# EAGLE design MainControlBoard (EAGLE 5.11)
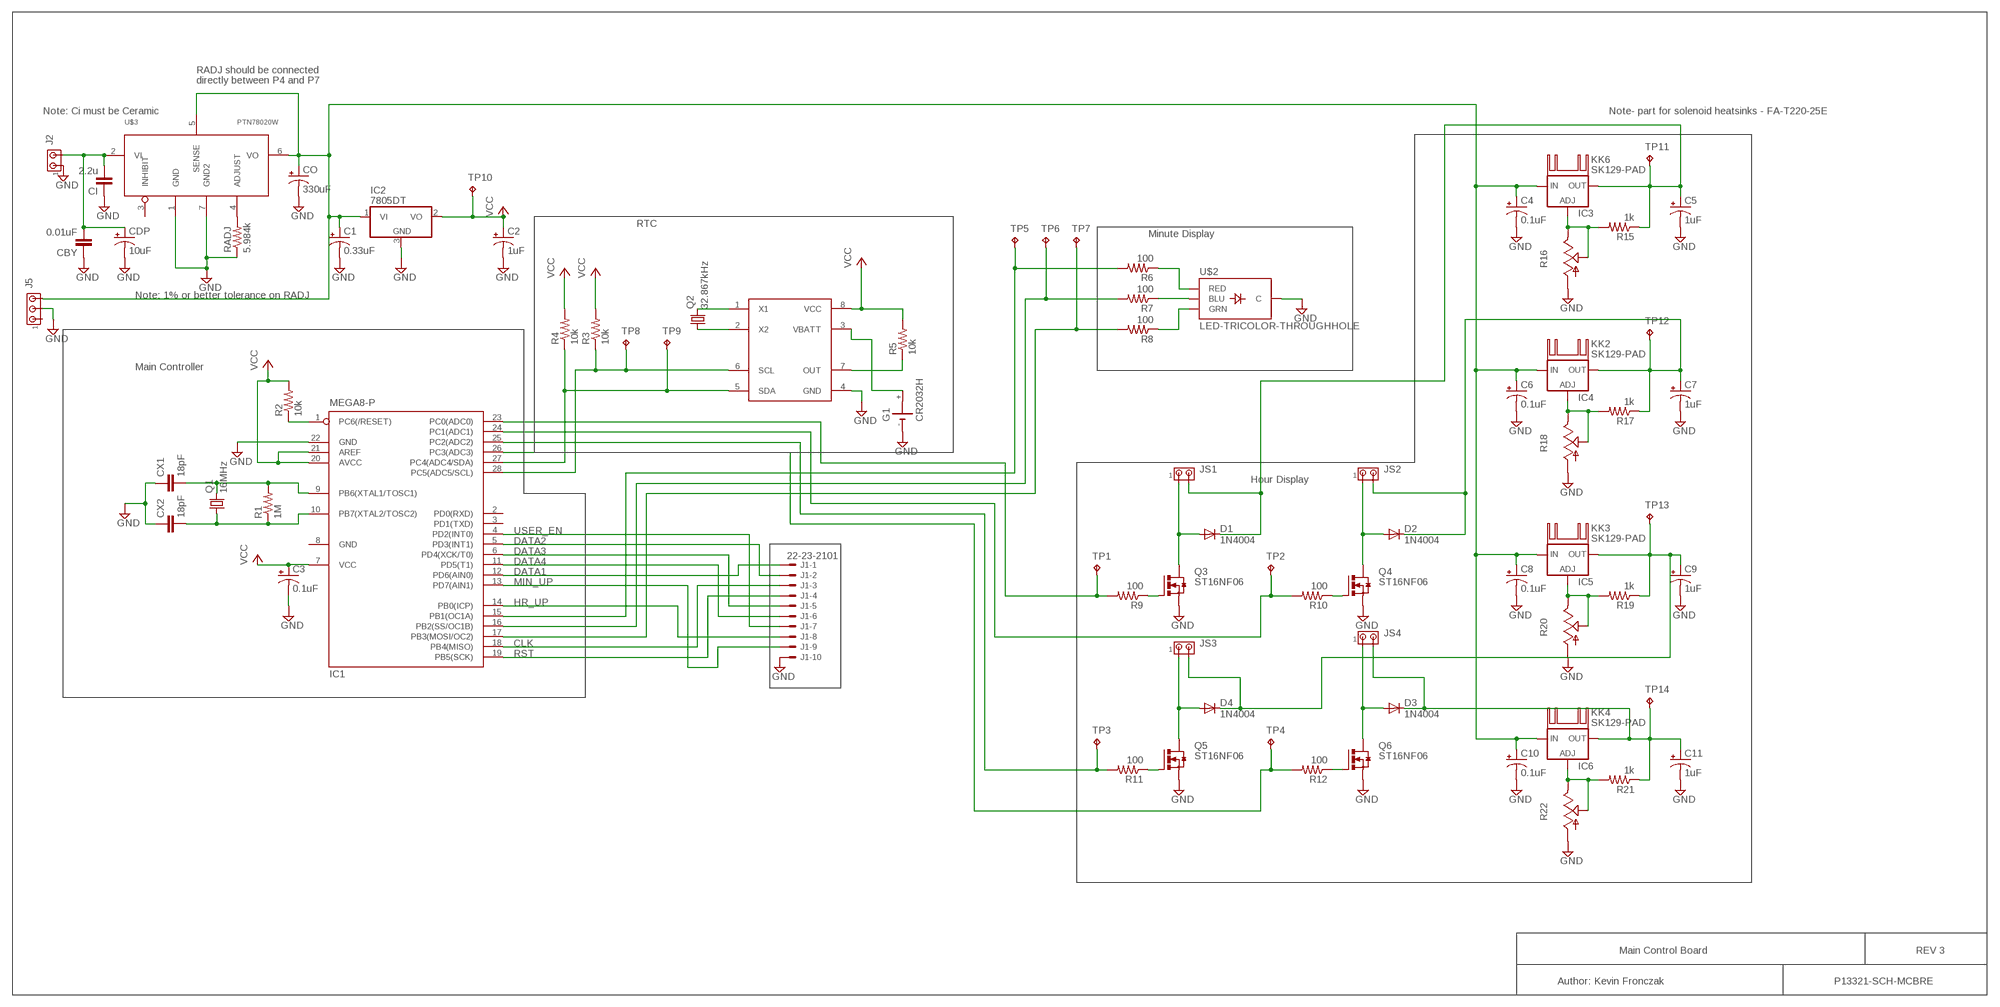
[diagram p0: schematic, sheet 1]

## Parts
C1  0.33uF  CPOL-USE2.5-7  [E2,5-7]
C2  1uF  CPOL-USE2.5-7  [E2,5-7]
C3  0.1uF  CPOL-USE2.5-7  [E2,5-7]
C4  0.1uF  CPOL-USE2.5-7  [E2,5-7]
C5  1uF  CPOL-USE2.5-7  [E2,5-7]
C6  0.1uF  CPOL-USE2.5-7  [E2,5-7]
C7  1uF  CPOL-USE2.5-7  [E2,5-7]
C8  0.1uF  CPOL-USE2.5-7  [E2,5-7]
C9  1uF  CPOL-USE2.5-7  [E2,5-7]
C10  0.1uF  CPOL-USE2.5-7  [E2,5-7]
C11  1uF  CPOL-USE2.5-7  [E2,5-7]
CBY  0.01uF  C2.5/2  [C2.5-2]
CDP  10uF  CPOL-USE2.5-7  [E2,5-7]
CI  2.2u  C2.5/2  [C2.5-2]
CO  330uF  CPOL-USE2.5-7  [E2,5-7]
CX1  18pF  C2.5/2  [C2.5-2]
CX2  18pF  C2.5/2  [C2.5-2]
D1  1N4004  [DO41-10]
D2  1N4004  [DO41-10]
D3  1N4004  [DO41-10]
D4  1N4004  [DO41-10]
G1  CR2032H  [CR2032H]
IC1  MEGA8-P  [DIL28-3]
IC2  7805DT  [TO252]
IC3  LM317TS  [317TS]
IC4  LM317TS  [317TS]
IC5  LM317TS  [317TS]
IC6  LM317TS  [317TS]
J1  22-23-2101  [22-23-2101]
J2  MTA02-100  [10X02MTA]
J5  MTA03-100  [10X03MTA]
JS1  MTA02-100  [10X02MTA]
JS2  MTA02-100  [10X02MTA]
JS3  MTA02-100  [10X02MTA]
JS4  MTA02-100  [10X02MTA]
KK2  SK129-PAD  [SK129]
KK3  SK129-PAD  [SK129]
KK4  SK129-PAD  [SK129]
KK6  SK129-PAD  [SK129]
Q1  16MHz  CRYSTALHC49S  [HC49/S]
Q2  32.867kHz  CRYSTALTC26H  [TC26H]
Q3  ST16NF06  [TO220BT]
Q4  ST16NF06  [TO220BT]
Q5  ST16NF06  [TO220BT]
Q6  ST16NF06  [TO220BT]
R1  1M  R-US_0207/10  [0207/10]
R2  10k  R-US_0207/10  [0207/10]
R3  10k  R-US_0207/10  [0207/10]
R4  10k  R-US_0207/10  [0207/10]
R5  10k  R-US_0207/10  [0207/10]
R6  100  R-US_0207/10  [0207/10]
R7  100  R-US_0207/10  [0207/10]
R8  100  R-US_0207/10  [0207/10]
R9  100  R-US_0207/10  [0207/10]
R10  100  R-US_0207/10  [0207/10]
R11  100  R-US_0207/10  [0207/10]
R12  100  R-US_0207/10  [0207/10]
R15  1k  R-US_0207/10  [0207/10]
R16  TRIM_US-RJ6S  [RJ6S]
R17  1k  R-US_0207/10  [0207/10]
R18  TRIM_US-RJ6S  [RJ6S]
R19  1k  R-US_0207/10  [0207/10]
R20  TRIM_US-RJ6S  [RJ6S]
R21  1k  R-US_0207/10  [0207/10]
R22  TRIM_US-RJ6S  [RJ6S]
RADJ  5.984k  R-US_0207/10  [0207/10]
TP1  TPPAD1-13  [P1-13]
TP2  TPPAD1-13  [P1-13]
TP3  TPPAD1-13  [P1-13]
TP4  TPPAD1-13  [P1-13]
TP5  TPPAD1-13  [P1-13]
TP6  TPPAD1-13  [P1-13]
TP7  TPPAD1-13  [P1-13]
TP8  TPPAD1-13  [P1-13]
TP9  TPPAD1-13  [P1-13]
TP10  TPPAD1-13  [P1-13]
TP11  TPPAD1-13  [P1-13]
TP12  TPPAD1-13  [P1-13]
TP13  TPPAD1-13  [P1-13]
TP14  TPPAD1-13  [P1-13]
U$1  DS1307  [DIL08]
U$2  LED-TRICOLOR-THROUGHHOLE  [LED-TRICOLOR-THROUGHHOLE]
U$3  PTN78020W  [DC-DCCONV]

## Nets
GND: C1.- C2.- C3.- C4.- C5.- C6.- C7.- C8.- C9.- C10.- C11.- CBY.1 CDP.- CI.1 CO.- CX1.1 CX2.1 G1.- IC1.22(GND) IC2.3(GND) J1.10 J2.1 J5.2 Q3.S Q4.S Q5.S Q6.S R16.A R18.A R20.A R22.A RADJ.1 U$1.4(GND) U$2.GND(C) U$3.1(GND) U$3.7(GND2)
N$1: IC1.12(PD6(AIN0)) J1.1
N$2: IC1.5(PD3(INT1)) J1.2
N$3: IC1.6(PD4(XCK/T0)) J1.5
N$4: IC1.11(PD5(T1)) J1.6
N$5: IC1.18(PB4(MISO)) J1.3
N$6: IC1.19(PB5(SCK)) J1.4
N$7: IC1.4(PD2(INT0)) J1.7
N$8: IC1.14(PB0(ICP)) J1.8
N$9: IC1.13(PD7(AIN1)) J1.9
N$10: IC1.28(PC5(ADC5/SCL)) R3.1 TP8.TP U$1.6(SCL)
N$11: IC1.27(PC4(ADC4/SDA)) R4.1 TP9.TP U$1.5(SDA)
N$12: CX1.2 IC1.9(PB6(XTAL1/TOSC1)) Q1.2 R1.2
N$13: CX2.2 IC1.10(PB7(XTAL2/TOSC2)) Q1.1 R1.1
N$14: R5.1 U$1.7(OUT)
N$15: IC1.1(PC6(/RESET)) R2.1
N$16: Q2.2 U$1.1(X1)
N$17: Q2.1 U$1.2(X2)
N$18: R6.1 U$2.RED
N$19: R7.1 U$2.BLU
N$20: R8.1 U$2.GRN
N$21: IC1.15(PB1(OC1A)) R6.2 TP5.TP
N$22: IC1.16(PB2(SS/OC1B)) R7.2 TP6.TP
N$23: IC1.17(PB3(MOSI/OC2)) R8.2 TP7.TP
N$24: Q5.G R11.1
N$25: C9.+ D4.C IC5.2(OUT) JS3.2 R19.1 TP13.TP
N$26: Q3.G R9.1
N$27: RADJ.2 U$3.4(ADJUST)
N$28: D1.A JS1.1 Q3.D
N$29: D2.A JS2.1 Q4.D
N$30: D3.A JS4.1 Q6.D
N$31: Q6.G R12.1
N$32: D4.A JS3.1 Q5.D
N$33: IC1.23(PC0(ADC0)) R9.2 TP1.TP
N$34: IC1.24(PC1(ADC1)) R10.2 TP2.TP
N$35: IC1.25(PC2(ADC2)) R11.2 TP3.TP
N$36: IC1.26(PC3(ADC3)) R12.2 TP4.TP
N$37: IC3.1(ADJ) R15.2 R16.E R16.S
N$38: Q4.G R10.1
N$39: C5.+ D1.C IC3.2(OUT) JS1.2 R15.1 TP11.TP
N$40: IC4.1(ADJ) R17.2 R18.E R18.S
N$41: C7.+ D2.C IC4.2(OUT) JS2.2 R17.1 TP12.TP
N$42: CBY.2 CDP.+ CI.2 J2.2 U$3.2(VI)
N$43: IC5.1(ADJ) R19.2 R20.E R20.S
N$47: IC6.1(ADJ) R21.2 R22.E R22.S
N$48: C11.+ D3.C IC6.2(OUT) JS4.2 R21.1 TP14.TP
N$51: G1.+ U$1.3(VBATT)
VCC: C2.+ C3.+ IC1.7(VCC) IC1.20(AVCC) IC1.21(AREF) IC2.2(VO) R2.2 R3.2 R4.2 R5.2 TP10.TP U$1.8(VCC)
VDD: C1.+ C4.+ C6.+ C8.+ C10.+ CO.+ IC2.1(VI) IC3.3(IN) IC4.3(IN) IC5.3(IN) IC6.3(IN) J5.3 U$3.5(SENSE) U$3.6(VO)
Unconnected: G1.+@1(+) IC1.2(PD0(RXD)) IC1.3(PD1(TXD)) J5.1 KK2.A2,5(K) KK2.B2,5(K) KK3.A2,5(K) KK3.B2,5(K) KK4.A2,5(K) KK4.B2,5(K) KK6.A2,5(K) KK6.B2,5(K) U$3.3(INHIBIT)

## Notes on the sheet
- RADJ should be connected
- directly between P4 and P7
- Note: Ci must be Ceramic | Note- part for solenoid heatsinks - FA-T220-25E
- RTC
- Minute Display
- Note: 1% or better tolerance on RADJ
- Main Controller
- Hour Display
- USER_EN
- DATA2
- DATA3
- DATA4
- DATA1
- MIN_UP
- HR_UP
- CLK
- RST
- Main Control Board | REV 3
- Author: Kevin Fronczak | P13321-SCH-MCBRE

## Power pins joined to a net without a drawn wire
GND: IC1.8(GND)

## Library data of the parts
C1-C11 CDP CO = resistor:CPOL-US: POLARIZED CAPACITOR, American symbol
CBY CI CX1 CX2 = capacitor-wima:C: CAPACITOR naming: grid - package width
D1-D4 = diode:1N4004: DIODE general purpose rectifier, 1 A
G1 = battery:CR2032H: LI BATTERY Varta
IC1 = atmel:MEGA8-P: MICROCONTROLLER 8 Kbytes FLASH, 1 kbytes SRAM, 512 bytes EEPROM, USART, 4-channel 10 bit ADC, 2-channel 8 bit ADC Pin compatible with Atmega48, ATMega88, ATMega168 Source: avr.lbr; OC_FARNELL: unknown; OC_NEWARK: unknown
IC2 = linear:78*: Positive VOLTAGE REGULATOR Source: http://cache.national.com/ds/LM/LM78L05.pdf http://www.fairchildsemi.com/ds/LM/LM7805.pdf
IC3-IC6 = v-reg:LM317TS: VOLTAGE REGULATOR
J1 = con-molex:22-23-2101: .100" (2.54mm) Center Header - 10 Pin; MF: MOLEX; MPN: 22-23-2101; OC_FARNELL: 1756828; OC_NEWARK: 94C0765
J2 JS1-JS4 = con-amp:MTA02-100: AMP connector; OC_FARNELL: unknown; OC_NEWARK: unknown
J5 = con-amp:MTA03-100: AMP connector; OC_FARNELL: unknown; OC_NEWARK: unknown
KK2-KK4 KK6 = heatsink:SK129-PAD: HEATSINK manufacturer Fischer/distributor Buerklin
Q1 = crystal:CRYSTAL: CRYSTAL; OC_FARNELL: 1667008; OC_NEWARK: unknown
Q2 = crystal:CRYSTAL: CRYSTAL; OC_FARNELL: unknown; OC_NEWARK: unknown
Q3-Q6 = transistor-power:ST16NF06: STP16NF06 Power MOSFET N-Channel 16A
R1-R12 R15 R17 R19 R21 = resistor:R-US_: RESISTOR, American symbol
R16 R18 R20 R22 = pot:TRIM_US-: POTENTIOMETER
RADJ = rcl:R-US_: RESISTOR, American symbol
TP1-TP14 = testpad:TP: Test pad
U$1 = maxim:DS1307: DS1307 RTC
U$2 = SparkFun:LED-TRICOLOR-THROUGHHOLE
U$3 = texas:PTN78020W: Adjustable Switched Regulator

## Board
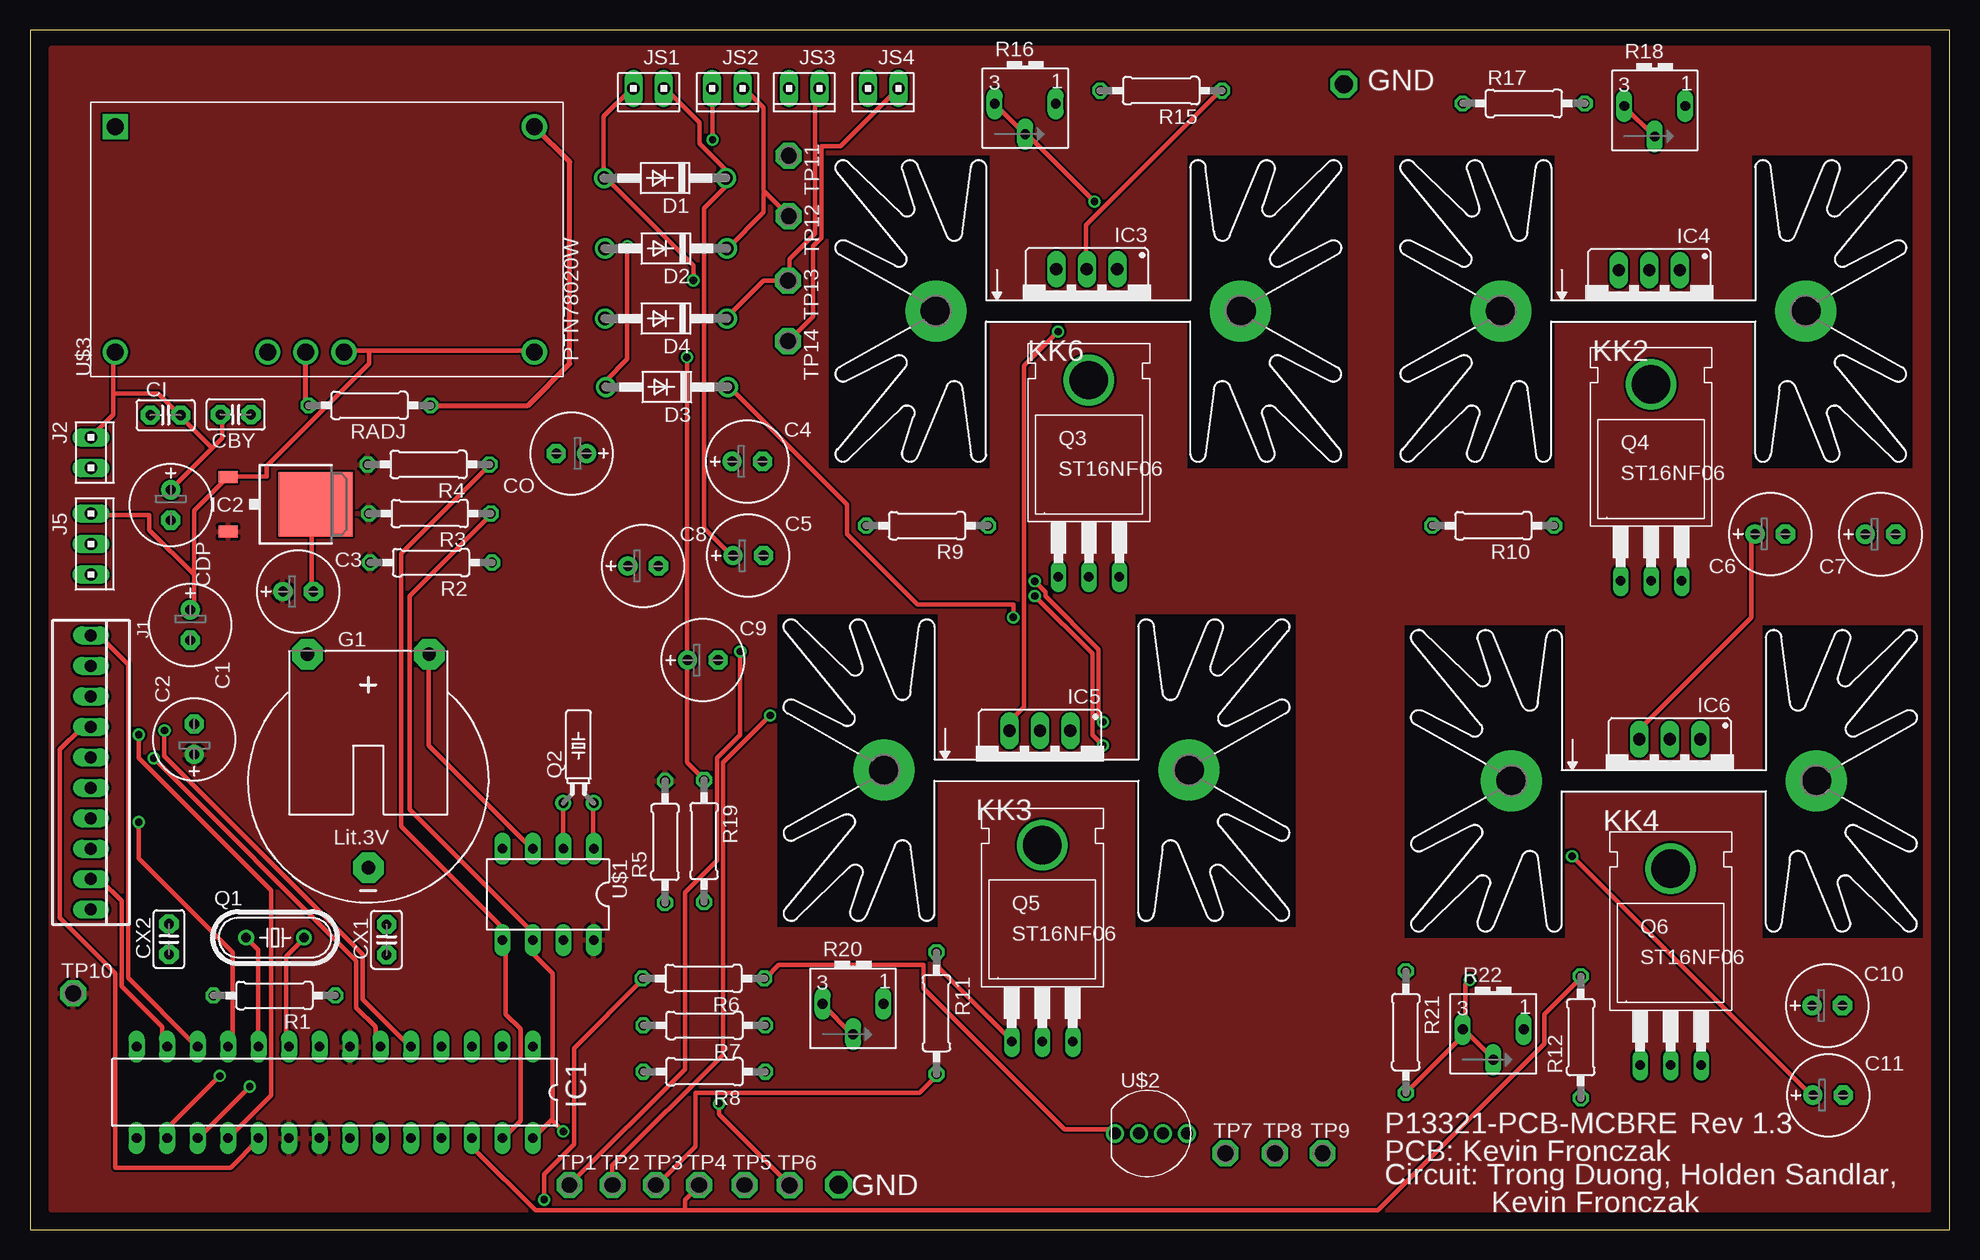
[diagram p1: board, top side]
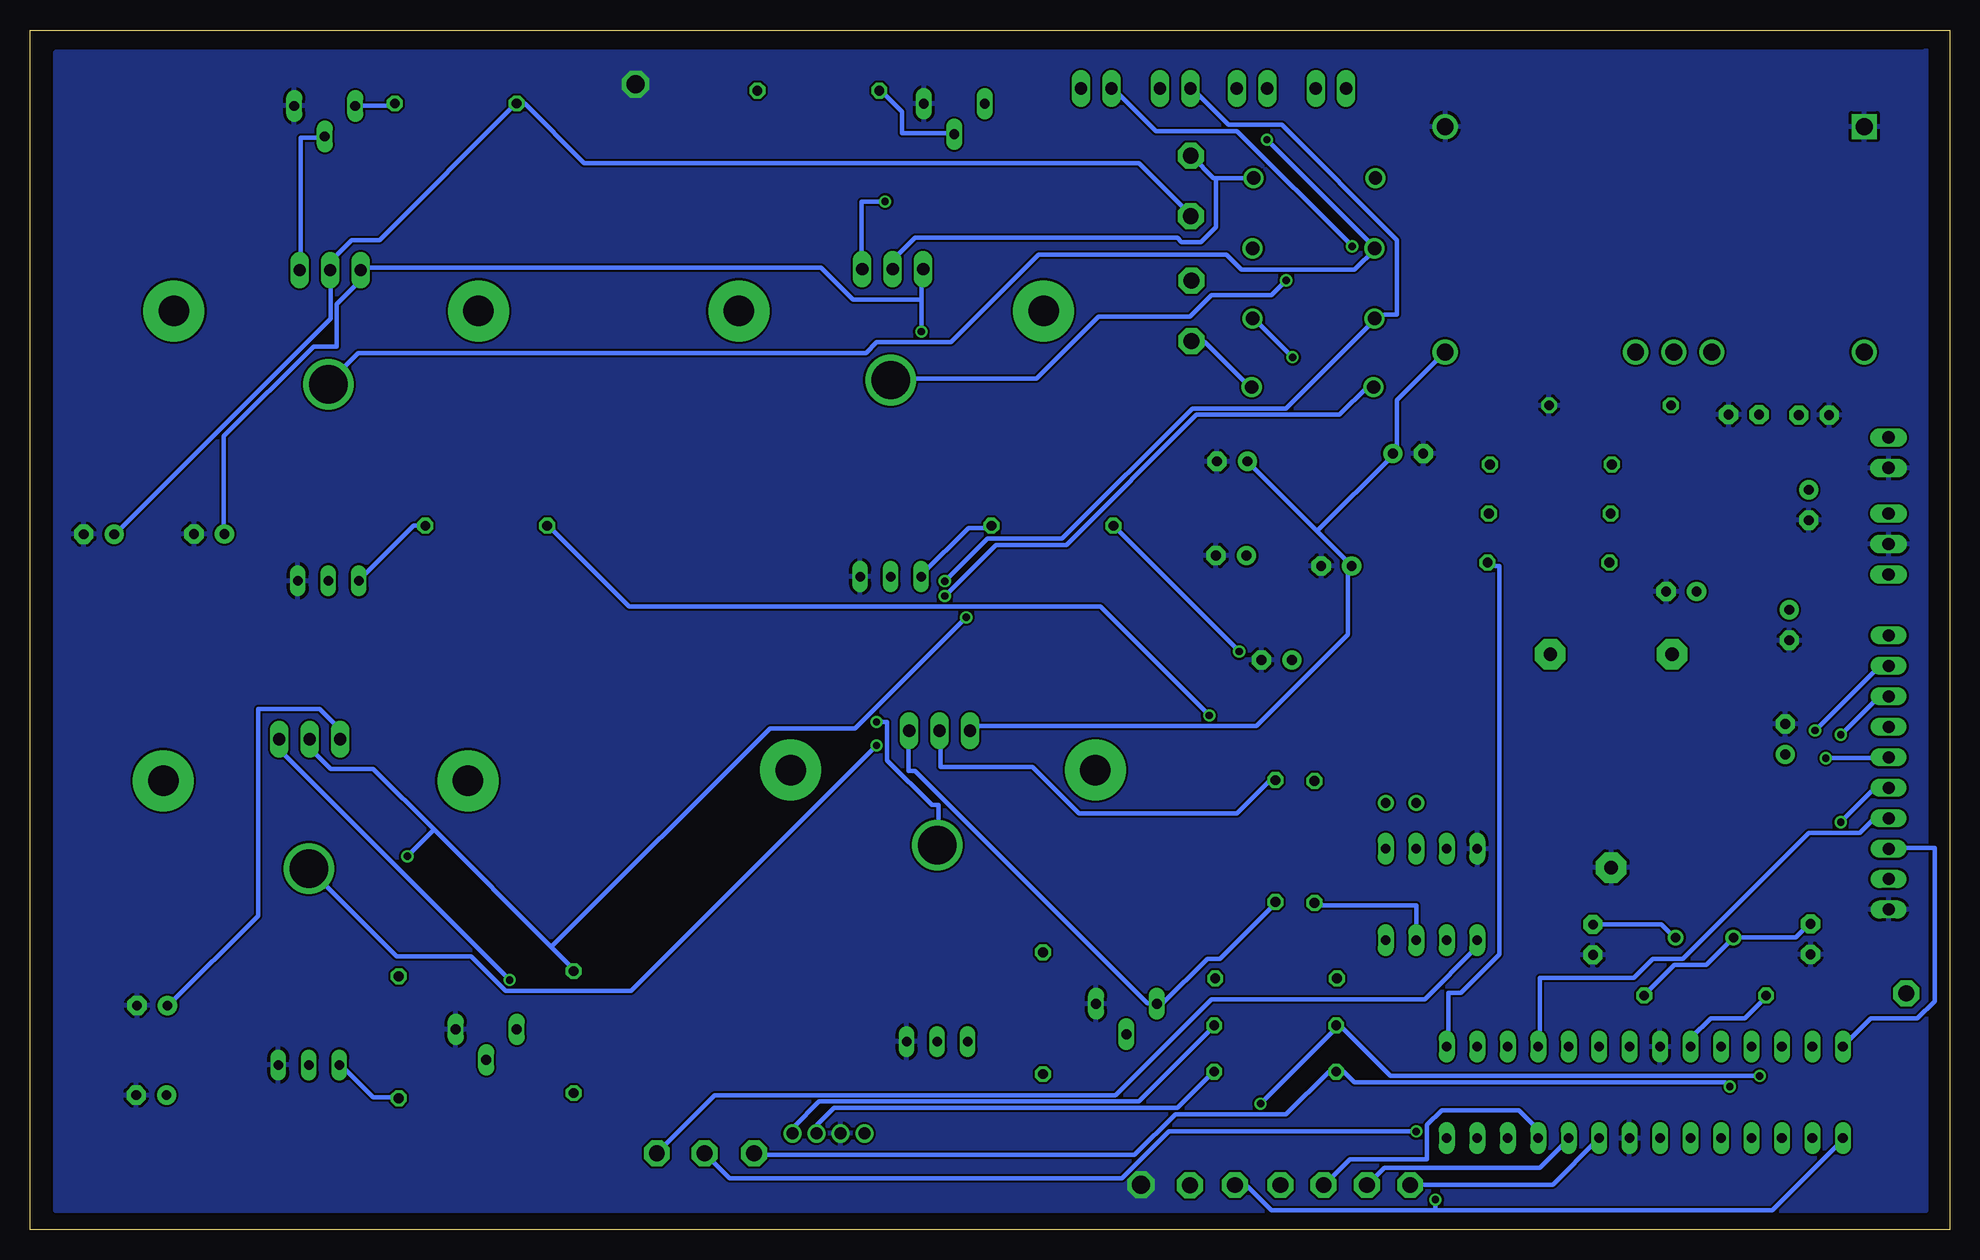
[diagram p2: board, bottom side, seen from below]

Size 160 x 100 mm. Coordinates in mm from the lower left corner, seen from the top.
Outline: 0,0 160,0 160,100 0,100 0,0
Copper layers (1*16): Top 0.035mm / dielectric 1.5mm / Bottom 0.035mm
Design rules "oshpark": minimum track width 14mil, minimum drill 24mil, track to track 7mil, track to pad 7mil, pad to pad 7mil, via to via 7mil, smd to smd 7mil, copper to edge 40mil, drill to drill 7mil, minimum pad ring 10mil, minimum via ring 8mil, stop-mask expansion 4mil, vias tented up to drill 0mil, thermal gap 10mil
tKeepout: area 43.2,29.6 to 48.3,44.8; area 7.6,73.7 to 41.9,91.4
bKeepout: area 7.6,73.7 to 41.9,91.4; area 43.2,29.7 to 48,44.6

### Footprints (pad centres in the part's own frame; a part is rotated, then mirrored left to right if it is on the bottom)
E2,5-7 = drill 0.813 pad 1.6 round: + -1.27,0 | drill 0.813 pad 1.6 octagon: - 1.27,0
C2.5-2 = drill 0.813 pad 1.6 octagon: 1 -1.27,0; 2 1.27,0
DO41-10 = drill 1.118 round: A 5.08,0; C -5.08,0
CR2032H = drill 1.118 pad 2.54 octagon: + 5.08,10.795; +@1 -5.08,10.795; - 0,-6.985
DIL28-3 = drill 0.813 long: 1 -16.51,-3.81; 2 -13.97,-3.81; 3 -11.43,-3.81; 4 -8.89,-3.81; 5 -6.35,-3.81; 6 -3.81,-3.81; 7 -1.27,-3.81; 8 1.27,-3.81; 9 3.81,-3.81; 10 6.35,-3.81; 11 8.89,-3.81; 12 11.43,-3.81; 13 13.97,-3.81; 14 16.51,-3.81; 15 16.51,3.81; 16 13.97,3.81; 17 11.43,3.81; 18 8.89,3.81; 19 6.35,3.81; 20 3.81,3.81; 21 1.27,3.81; 22 -1.27,3.81; 23 -3.81,3.81; 24 -6.35,3.81; 25 -8.89,3.81; 26 -11.43,3.81; 27 -13.97,3.81; 28 -16.51,3.81
TO252 = smd 1 x 1.6: 1 -2.28,-4.8; 2 2.28,-4.8 | smd 5.4 x 6.2: 3 0,2.5
317TS = drill 1.016 long: 1 -2.54,-2.54; 2 0,-2.54; 3 2.54,-2.54
22-23-2101 = drill 1 long: 1 -11.43,0; 2 -8.89,0; 3 -6.35,0; 4 -3.81,0; 5 -1.27,0; 6 1.27,0; 7 3.81,0; 8 6.35,0; 9 8.89,0; 10 11.43,0
10X02MTA = drill 1.016 long: 1 1.27,0; 2 -1.27,0
10X03MTA = drill 1.016 long: 1 2.54,0; 2 0,0; 3 -2.54,0
SK129 = drill 2.54 pad 5.08 round: A2,5 -12.7,-0.889; B2,5 12.7,-0.889
HC49/S = drill 0.813 round: 1 -2.413,0; 2 2.413,0
TC26H = drill 0.813 round: 1 -1.27,0; 2 1.27,0
TO220BT = drill 3.2 pad 3.81 round: D 0,10.541 | drill 0.8 long: G -2.54,-5.842; NC 0,-5.842; S 2.54,-5.842
0207/10 = drill 0.813 octagon: 1 -5.08,0; 2 5.08,0
RJ6S = drill 0.813 long: A 2.54,0; E -2.54,0; S 0,-2.54
P1-13 = drill 1.321 pad 2.159 octagon: TP 0,0
DIL08 = drill 0.813 long: 1 -3.81,-3.81; 2 -1.27,-3.81; 3 1.27,-3.81; 4 3.81,-3.81; 5 3.81,3.81; 6 1.27,3.81; 7 -1.27,3.81; 8 -3.81,3.81
LED-TRICOLOR-THROUGHHOLE = drill 1 round: BLU 3,0; GND -1,0; GRN 1,0; RED -3,0
DC-DCCONV = drill 1.4 pad 1.778 square: 1 -17.018,9.398 | drill 1.4 pad 1.778 round: 2 -17.018,-9.398; 3 -4.318,-9.398; 4 -1.143,-9.398; 5 2.032,-9.398; 6 17.907,-9.398; 7 17.907,9.398

### Placement (x,y rotation side)
C1  13.36,50.39 270 top
C2  13.69,40.87 90 top
C3  22.35,53.19 0 top
C4  59.79,64.03 0 top
C5  59.87,56.18 0 top
C6  145.06,57.99 0 top
C7  154.25,57.96 0 top
C8  51.1,55.32 0 top
C9  56.08,47.47 0 top
C10  149.81,18.67 0 top
C11  149.89,11.2 0 top
CBY  17.14,67.94 180 top
CDP  11.73,60.4 270 top
CI  11.3,67.89 0 top
CO  45.14,64.69 180 top
CX1  29.72,24.16 90 top
CX2  11.58,24.21 90 top
D1  52.93,87.66 180 top
D2  53.01,81.79 180 top
D3  53.09,70.23 180 top
D4  53.01,75.95 180 top
G1  28.19,37.16 0 top
IC1  25.4,11.43 180 top
IC2  21.31,60.45 270 top
IC3  88.09,77.52 180 top
IC4  134.98,77.44 180 top
IC5  84.18,39.04 180 top
IC6  136.68,38.33 180 top
J1  5.08,38.1 270 top
J2  5.08,64.77 270 top
J5  5.08,57.15 270 top
JS1  51.56,95.12 180 top
JS2  58.14,95.12 180 top
JS3  64.54,95.12 180 top
JS4  71.12,95.12 180 top
KK2  135.31,77.47 0 top
KK3  83.9,39.19 0 top
KK4  136.19,38.3 0 top
KK6  88.21,77.47 0 top
Q1  20.42,24.33 0 top
Q2  45.72,35.56 0 top
Q3  88.27,60.27 0 top
Q4  135.13,59.92 0 top
Q5  84.38,21.51 0 top
Q6  136.75,19.56 0 top
R1  20.37,19.51 180 top
R2  33.43,55.6 180 top
R3  33.32,59.69 180 top
R4  33.22,63.78 180 top
R5  52.93,32.31 90 top
R6  56.13,20.93 180 top
R7  56.21,17.02 180 top
R8  56.21,13.16 180 top
R9  74.78,58.67 180 top
R10  121.97,58.67 180 top
R11  75.56,18.03 270 top
R12  129.26,16.03 90 top
R15  94.28,94.95 180 top
R16  82.96,93.85 0 top
R17  124.51,93.88 0 top
R18  135.43,93.68 0 top
R19  56.18,32.38 270 top
R20  68.61,18.82 0 top
R21  114.68,16.46 270 top
R22  121.97,16.69 0 top
RADJ  28.3,68.71 180 top
TP1  44.96,3.71 0 top
TP2  48.56,3.71 0 top
TP3  52.17,3.71 0 top
TP4  55.78,3.71 0 top
TP5  59.56,3.71 0 top
TP6  63.32,3.68 0 top
TP7  99.64,6.35 0 top
TP8  103.78,6.35 0 top
TP9  107.75,6.35 0 top
TP10  3.61,19.68 0 top
TP11  63.25,89.51 270 top
TP12  63.25,84.48 270 top
TP13  63.2,79.1 270 top
TP14  63.2,74.07 270 top
U$1  43.18,27.94 180 top
U$2  93.45,8 0 top
U$3  24.13,82.55 0 top

### Tracks (layer width: path | path; a pad name or v marks a point on that pad's centre or on a via)
GND  (via drill 1.5)
  Top 0.356: IC2.3 23.65,60.45 23.47,60.27 23.47,53.34 C3.-
  Top 0.406: RADJ.1 41.5,68.71 44.98,72.19 44.98,89 U$3.7
  other vias: 67.39,3.73 109.52,95.48
  pour Bottom: 2.13,98.15 157.89,98.15 157.89,1.6 1.96,1.6 1.96,98.32
N$1
  Top 0.356: IC1.12 13.87,15.29 8.18,20.98 8.18,47.12 5.87,49.43 5.16,49.43 J1.1
N$2  (via drill 0.61)
  Top 0.356: v11.2,41.6 11.2,39.47 27.74,22.94 27.74,19.2 31.65,15.29 IC1.5
  Bottom 0.356: v11.2,41.6 5.87,46.94 5.16,46.94 J1.2
N$3  (via drill 0.61)
  Top 0.356: v10.31,39.29 27.2,22.4 27.2,18.49 28.8,16.89 28.8,15.65 IC1.6
  Bottom 0.356: v10.31,39.29 5.16,39.29 J1.5
N$4  (via drill 0.61)
  Top 0.356: v9.07,33.96 9.07,30.94 16.89,23.11 16.89,15.65 16.54,15.29 IC1.11
  Bottom 0.356: v9.07,33.96 6.22,36.8 5.16,36.8 J1.6
N$5  (via drill 0.61)
  Top 0.356: v9.07,41.25 9.07,39.29 20.09,28.27 20.09,11.2 IC1.18
  Bottom 0.356: v9.07,41.25 5.87,44.45 J1.3
N$6
  Top 0.356: IC1.19 19.02,7.47 16.71,5.16 7.11,5.16 7.11,21.34 2.49,25.96 2.49,40.01 4.27,41.78 4.98,41.78 J1.4
N$7
  Bottom 0.356: IC1.4 34.14,15.29 34.14,20.98 26.31,20.98 24.71,22.58 22.23,22.58 11.73,33.07 7.47,33.07 6.4,34.14 5.16,34.14 J1.7
N$8
  Bottom 0.356: IC1.14 8.89,15.29 6.58,17.6 2.67,17.6 1.25,19.02 1.25,31.83 4.98,31.83 J1.8
N$9
  Top 0.356: IC1.13 11.02,15.65 11.02,16.89 7.64,20.27 7.64,27.38 5.87,29.16 5.16,29.16 J1.9
N$10  (via drill 0.61)
  Top 0.356: 43.47,9.16 43.56,9.25 43.56,21.34 41.96,22.94 41.96,24 U$1.6 41.78,24.18 41.78,24.89 31.65,35.03 31.65,52.81 38.41,59.56 R3.1 | 43.47,9.16 41.96,7.64 IC1.28 | 43.47,9.16 v44.45,8.18
  Bottom 0.356: v44.45,8.18 65.08,8.18 68.99,4.27 101.7,4.27 TP8.TP
N$11
  Top 0.356: IC1.27 39.47,7.64 40.89,9.07 40.89,16.71 39.65,17.96 39.65,23.82 39.47,24 U$1.5 39.29,24.18 39.29,25.25 30.94,33.6 30.94,56.36 38.23,63.65 R4.1
  Bottom 0.356: TP9.TP 107.75,6.4 102.95,11.2 69.52,11.2 61.52,19.2 43.74,19.2 39.47,23.47 39.47,24 U$1.5
N$12
  Top 0.356: Q1.2 22.76,24.18 21.34,22.76 21.34,16.54 21.51,16.36 21.51,15.29 IC1.9
  Bottom 0.356: Q1.2 22.94,24.36 24,25.43 CX1.2 | R1.2 15.29,19.38 17.07,17.6 19.91,17.6 21.51,16 21.51,15.29 IC1.9
N$13
  Top 0.356: IC1.10 19.02,15.29 19.02,23.29 18.14,24.18 Q1.1
  Bottom 0.356: R1.1 25.43,19.56 22.94,22.05 20.27,22.05 18.14,24.18 Q1.1 17.96,24.36 12.8,24.36 11.73,25.43 CX2.2
N$14
  Bottom 0.356: U$1.7 44.45,27.03 52.27,27.03 52.45,27.2 52.81,27.2 R5.1
N$15
  Bottom 0.356: IC1.1 41.78,15.29 41.78,19.74 40.72,19.74 37.52,22.94 37.52,55.3 37.87,55.3 38.05,55.47 38.41,55.47 R2.1
N$16
  Top 0.356: U$1.1 46.94,31.83 46.94,35.56 Q2.2
N$17
  Top 0.356: U$1.2 Q2.1
N$18
  Top 0.356: R6.1 61.34,20.98 62.41,22.05 74.5,22.05 74.5,20.09 86.23,8.36 90.32,8.36 90.32,8 U$2.RED
N$19
  Bottom 0.356: R7.1 61.34,16.89 67.56,10.67 94.23,10.67 96.37,8.53 96.37,8 U$2.BLU
N$20
  Bottom 0.356: R8.1 61.34,13.16 64.36,10.13 92.99,10.13 94.41,8.71 94.41,8 U$2.GRN
N$21  (via drill 0.61)
  Top 0.356: v42.85,2.49 42.85,4.62 45.34,7.11 45.34,15.11 51.03,20.8 R6.2
  Bottom 0.356: 42.85,1.6 56.54,1.6 58.5,3.56 59.56,3.56 TP5.TP | 42.85,1.6 14.76,1.6 8.89,7.47 IC1.15 | 42.85,1.6 v42.85,2.49
N$22  (via drill 0.61)
  Top 0.356: v15.82,12.8 11.73,8.71 11.73,7.82 11.56,7.64 IC1.16 | v57.43,10.49 57.43,9.6 63.3,3.73 TP6.TP
  Bottom 0.356: v15.82,12.8 46.58,12.8 50.67,16.89 51.03,16.89 R7.2 51.03,16.71 51.21,16.71 v57.43,10.49
N$23  (via drill 0.61)
  Top 0.356: v18.31,11.91 14.05,7.64 IC1.17
  Bottom 0.356: v18.31,11.91 18.67,12.27 49.61,12.27 50.49,13.16 R8.2 51.74,13.16 55.3,9.6 64.54,9.6 67.92,6.22 99.57,6.22 TP7.TP
N$24
  Top 0.356: R11.1 75.74,22.94 75.74,21.87 81.79,15.82 Q5.G
N$25  (via drill 0.61)
  Top 0.356: JS3.2 65.79,95.12 65.43,94.77 65.43,83.03 63.3,80.9 63.3,79.12 TP13.TP 63.12,79.12 61.16,79.12 58.14,76.1 D4.C | 54.76,47.47 54.76,38.94 56.19,37.52 R19.1 | 54.76,47.47 v54.76,72.72 | 54.76,47.47 C9.+
  Bottom 0.356: IC5.2 84.1,41.43 84.1,38.58 76.45,38.58 72.54,34.67 59.38,34.67 56.72,37.34 56.19,37.34 R19.1 | v54.76,72.72 57.96,75.92 D4.C
N$26
  Bottom 0.356: Q3.G 85.7,54.59 81.79,58.5 80.19,58.5 80.01,58.67 R9.1
N$27
  Top 0.406: U$3.4 22.99,68.94 RADJ.2
N$28  (via drill 0.61)
  Top 0.356: JS1.1 50.14,95.12 47.83,92.81 47.83,87.66 D1.A 48.01,87.66 55.3,80.37 v55.3,79.12
  Bottom 0.356: v55.3,79.12 56.54,77.88 61.52,77.88 63.3,76.1 70.94,76.1 76.1,70.94 88.19,70.94 Q3.D
N$29  (via drill 0.61)
  Top 0.356: v56.9,90.86 56.9,95.12 JS2.1
  Bottom 0.356: 47.83,81.79 v56.9,90.86 | 47.83,81.79 49.61,80.01 59.03,80.01 60.27,81.25 75.92,81.25 83.21,73.97 89.43,73.97 90.32,73.08 132.64,73.08 135.13,70.59 Q4.D | D2.A 47.83,81.79
N$30  (via drill 0.61)
  Top 0.356: v49.78,81.97 49.78,72.54 48.01,70.76 D3.A | v89.43,40.36 88.54,41.25 88.54,48.01 v83.74,52.81
  Bottom 0.356: v49.78,81.97 59.38,91.57 66.14,91.57 69.7,95.12 JS4.1 | v89.43,40.36 109.88,19.91 120.37,19.91 123.22,22.76 129.44,22.76 136.73,30.05 Q6.D | v83.74,52.81 79.48,57.07 73.61,57.07 62.76,67.92 50.85,67.92 48.54,70.23 D3.A
N$31
  Bottom 0.356: Q6.G 134.06,13.69 131.39,11.02 129.26,11.02 R12.1
N$32  (via drill 0.61)
  Top 0.356: v89.43,42.32 89.08,42.67 89.08,48.36 84.63,52.81 84.63,53.16 v83.74,54.05
  Bottom 0.356: JS3.1 63.12,95.12 60.1,92.1 55.65,92.1 46.05,82.5 46.05,76.28 47.12,76.28 47.3,76.1 47.83,76.1 D4.A 47.83,75.92 55.3,68.45 63.12,68.45 73.97,57.61 80.19,57.61 v83.74,54.05 | v89.43,42.32 88.54,42.32 88.54,39.12 84.81,35.38 84.28,35.38 84.28,32.18 Q5.D
N$33  (via drill 0.61)
  Top 0.356: v59.21,48.18 59.21,41.25 57.25,39.29 57.25,30.76 54.59,28.09 54.59,13.34 TP1.TP
  Bottom 0.356: IC1.23 29.34,7.47 33.07,3.73 44.81,3.73 TP1.TP | v59.21,48.18 R9.2
N$34  (via drill 0.61)
  Top 0.356: v61.7,42.85 57.78,38.94 57.78,14.58 48.54,5.33 48.54,3.73 TP2.TP
  Bottom 0.356: IC1.24 31.83,7.47 34.14,5.16 47.12,5.16 TP2.TP | v61.7,42.85 70.76,51.92 110.06,51.92 116.81,58.67 R10.2
N$35
  Top 0.356: R11.2 75.56,12.8 74.14,11.38 55.47,11.38 55.47,6.93 52.27,3.73 TP3.TP
  Bottom 0.356: IC1.25 34.31,7.64 34.31,8.71 34.67,8.71 35.92,9.96 42.32,9.96 43.56,8.71 43.56,5.87 49.96,5.87 52.09,3.73 TP3.TP
N$36
  Top 0.356: 54.59,1.6 42.14,1.6 37.16,6.58 37.16,7.29 IC1.26 | 54.59,1.6 54.59,2.49 55.65,3.56 TP4.TP | 54.59,1.6 112.37,1.6 126.24,15.47 126.24,17.96 129.26,20.98 R12.2
N$37  (via drill 0.61)
  Top 0.356: R16.E 80.54,93.7 82.86,91.39 R16.S 83.03,91.39 v88.72,85.7
  Bottom 0.356: R15.2 89.08,94.94 87.3,93.17 87.3,91.39 83.03,91.39 R16.S | v88.72,85.7 90.68,85.7 90.68,80.19 IC3.1
N$38
  Bottom 0.356: Q4.G 132.46,54.23 128.02,58.67 R10.1
N$39
  Top 0.356: R15.1 99.21,94.94 88.01,83.74 88.01,80.19 IC3.2 | 57.96,87.66 57.96,88.37 55.83,90.5 55.83,92.28 52.98,95.12 JS1.2 | 57.96,87.66 57.96,86.94 56.19,85.17 56.19,58.5 58.5,56.19 C5.+ | 57.96,87.66 D1.C
  Bottom 0.356: 61.16,87.66 61.34,87.66 63.12,89.43 TP11.TP | D1.C 61.16,87.66 | 61.16,87.66 61.16,83.57 62.41,82.32 64.01,82.32 64.36,82.68 86.23,82.68 87.66,81.25 88.01,81.25 88.01,80.19 IC3.2
N$40
  Top 0.356: R18.S 135.31,91.21 132.99,93.52 R18.E
  Bottom 0.356: R17.2 129.62,93.88 129.79,93.7 132.82,93.7 R18.E | IC4.1 137.44,80.01 137.44,91.03 135.48,91.03 R18.S
N$41
  Top 0.356: 61.25,86.5 63.12,84.63 TP12.TP | 61.25,86.5 61.16,86.59 61.16,93.52 59.56,95.12 JS2.2 | D2.C 58.14,81.79 61.16,84.81 61.16,86.41 61.25,86.5
  Bottom 0.356: C7.+ 152.91,57.96 134.95,75.92 134.95,79.83 IC4.2 134.95,80.01 134.95,80.72 133.17,82.5 130.86,82.5 119.48,93.88 R17.1 118.77,93.88 113.79,88.9 67.56,88.9 63.3,84.63 TP12.TP
N$42
  Top 0.356: 15.2,65.16 16,65.96 16,67.92 CBY.2 | 15.2,65.16 11.73,61.7 CDP.+ | 15.2,65.16 12.62,67.74 CI.2 12.45,67.92 10.67,69.7 6.93,69.7 | 6.93,69.7 6.93,72.9 7.11,73.08 U$3.2 | 6.93,69.7 6.93,67.92 5.16,66.14 J2.2
N$43
  Top 0.356: R20.S 68.45,16.36 66.14,18.67 R20.E
  Bottom 0.356: R19.2 56.19,27.2 60.81,22.58 61.87,22.58 65.61,18.85 65.96,18.85 R20.E 66.14,18.85 66.85,18.85 86.23,38.23 86.77,38.23 86.77,41.43 IC5.1
N$47  (via drill 0.61)
  Top 0.356: R21.2 119.3,16 119.3,16.54 R22.E | R22.S 121.97,14.22 119.48,16.71 R22.E | v120.02,20.8 119.66,20.45 119.66,16.71 R22.E
  Bottom 0.356: v120.02,20.8 138.86,39.65 139.22,39.65 IC6.1
N$48  (via drill 0.61)
  Top 0.356: JS4.2 72.36,95.12 67.56,90.32 65.96,90.32 65.96,82.68 65.25,81.97 65.25,76.1 63.3,74.14 TP14.TP | v128.55,31.11 148.46,11.2 C11.+ | v81.97,51.03 81.97,52.09 73.97,52.09 68.1,57.96 68.1,60.45 58.32,70.23 D3.C
  Bottom 0.356: D3.C 58.32,70.23 62.05,73.97 63.12,73.97 TP14.TP | 126.33,33.34 131.39,38.41 134.95,38.41 136.55,40.01 136.55,40.72 IC6.2 | 116.55,23.56 126.33,33.34 | 116.55,23.56 114.68,21.69 R21.1 | 126.33,33.34 v128.55,31.11 | v81.97,51.03 91.21,41.78 98.32,41.78 116.55,23.56
N$51
  Top 0.356: U$1.3 41.78,31.83 33.25,40.36 33.25,47.83 G1.+
VCC
  pour Top: 1.78,98.5 158.24,98.5 158.24,1.6 1.78,1.6
VDD  (via drill 0.61)
  Top 0.356: IC6.3 134.24,40.89 134.59,41.25 134.59,42.14 143.49,51.03 143.49,57.25 143.66,57.43 143.66,57.96 C6.+ | 13.69,54.59 13.69,52.45 13.51,52.27 13.51,51.74 C1.+ | 13.69,54.59 13.69,59.92 16.36,62.59 IC2.1 16.54,62.76 19.74,62.76 19.74,63.65 28.27,72.19 28.27,73.25 | 13.69,54.59 9.96,58.32 9.96,59.56 5.16,59.56 J5.3 | 28.27,73.25 41.96,73.25 U$3.6 | 28.27,73.25 26.31,73.25 U$3.5 | v85.7,74.85 82.86,72.01 82.86,43.56 81.79,42.49 81.79,41.6 IC5.3
  Bottom 0.356: C6.+ 143.84,58.14 143.84,66.14 136.37,73.61 134.42,73.61 134.42,77.17 132.82,78.77 132.46,78.77 132.46,79.83 IC4.3 132.28,80.01 132.1,80.19 94.06,80.19 91.39,77.52 85.7,77.52 | C10.+ 148.46,18.67 141,26.14 141,43.38 135.84,43.38 134.24,41.78 134.24,40.89 IC6.3 | IC5.3 81.25,41.96 57.78,41.96 50.14,49.61 50.14,55.3 49.96,55.3 C8.+ 49.96,55.47 52.72,58.23 | v85.7,74.85 85.7,77.52 | 85.7,77.52 85.7,80.01 IC3.3 | 52.72,58.23 C4.+ | 52.72,58.23 46.41,64.54 CO.+ 46.41,64.72 46.05,64.72 46.05,69.16 42.14,73.08 U$3.6

### Text on the board
tPlace: GND | P13321-PCB-MCBRE | Rev 1.3 | PCB: Kevin Fronczak | Circuit: Trong Duong, Holden Sandlar, | GND | Kevin Fronczak